# EAGLE design Spectacle_Button_Board (EAGLE 7.2.0)
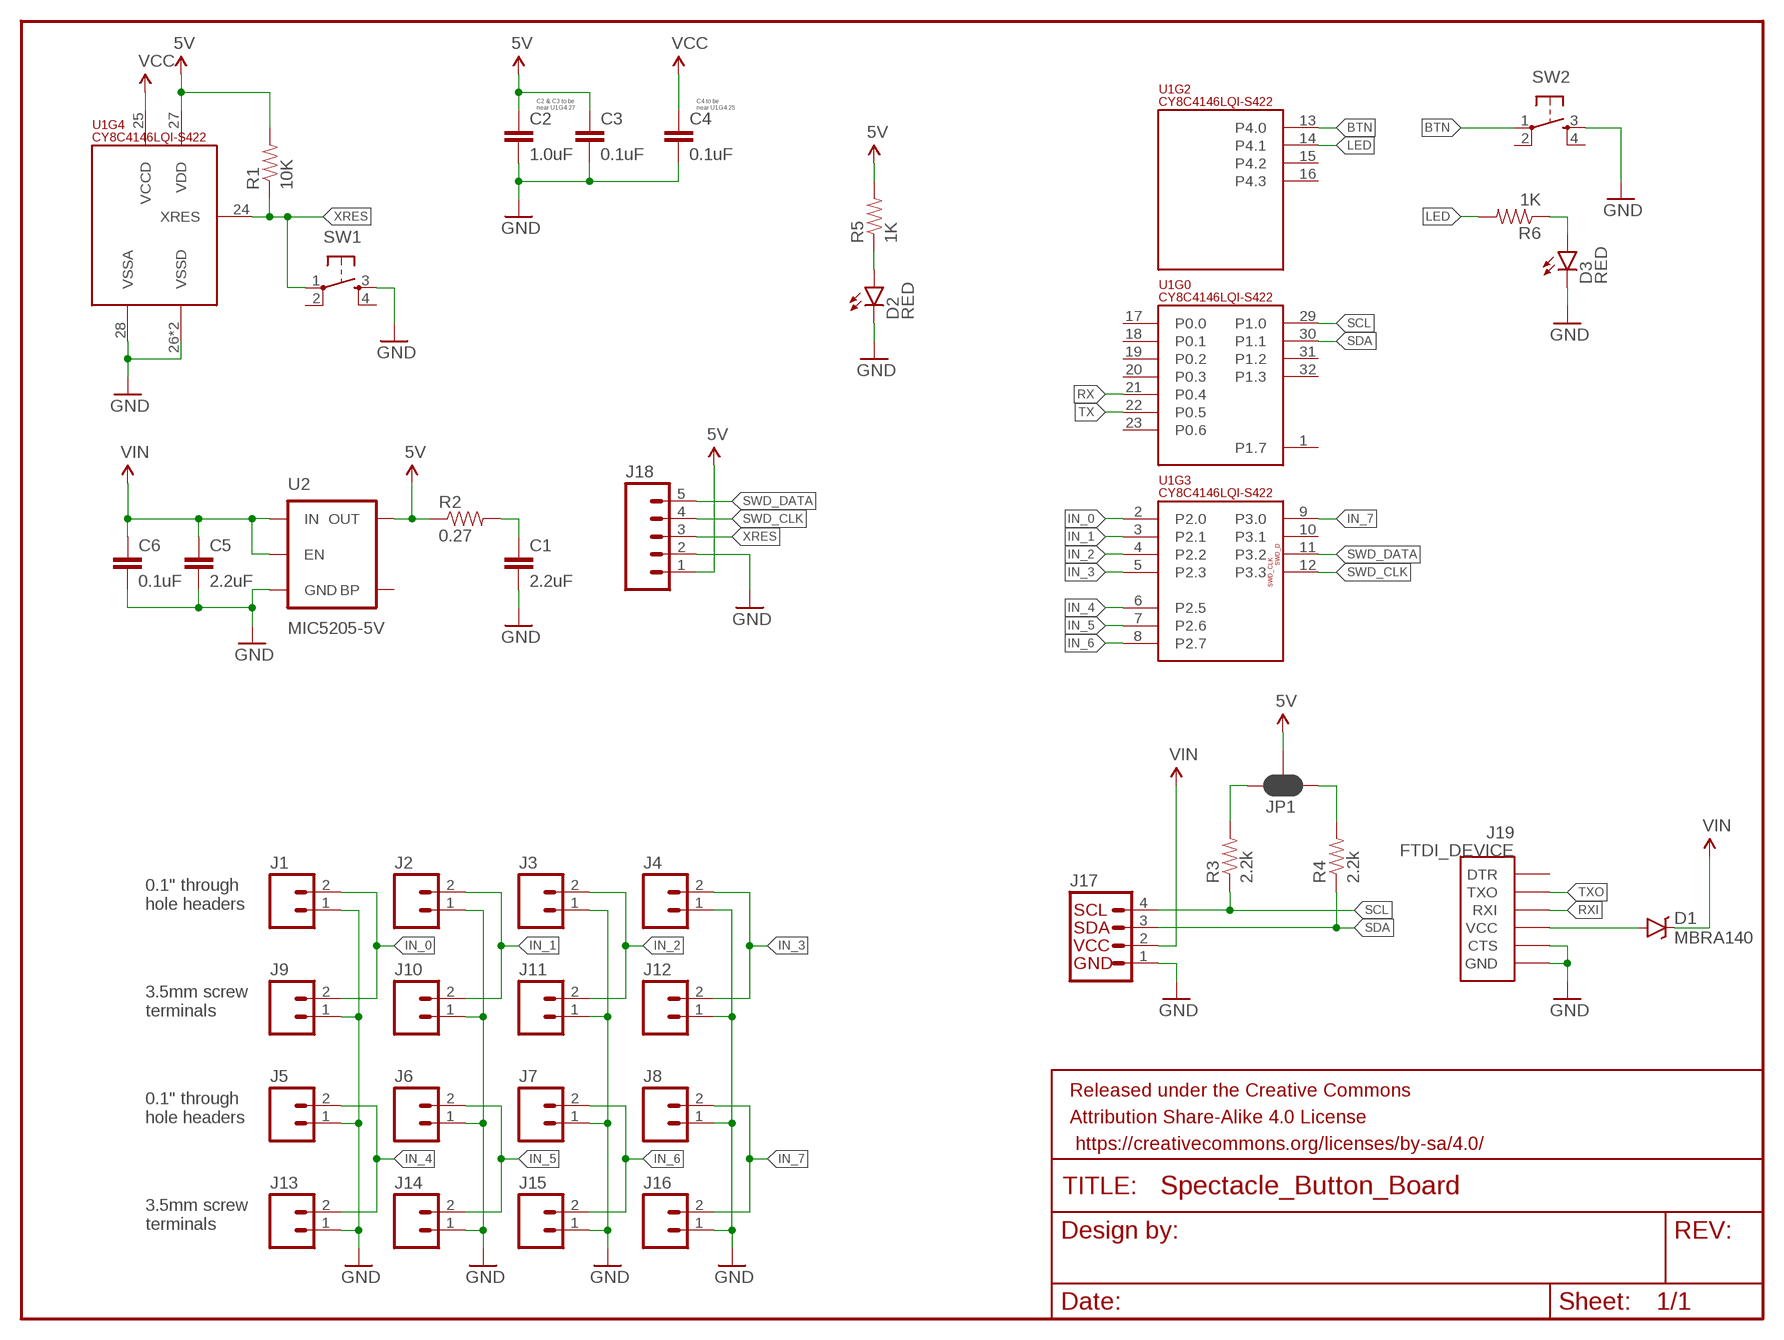
[diagram p0: schematic, sheet 1]

## Parts
C1  2.2uF  2.2UF-10V-20%(0603)  [0603-CAP]
C2  1.0uF  1.0UF-16V-10%(0402)  [0402-CAP]
C3  0.1uF  0.1UF-16V(+-10%)(0402)  [0402-CAP]
C4  0.1uF  0.1UF-16V(+-10%)(0402)  [0402-CAP]
C5  2.2uF  2.2UF-10V-20%(0603)  [0603-CAP]
C6  0.1uF  0.1UF-16V(+-10%)(0402)  [0402-CAP]
D1  MBRA140  DIODE-SCHOTTKY-MBRA140  [SMA-DIODE]
D2  RED  LED-RED0603  [LED-0603]
D3  RED  LED-RED0603  [LED-0603]
FRAME1  FRAME-LETTER  [CREATIVE_COMMONS]
J1  M02PTH  [1X02]
J2  M02PTH  [1X02]
J3  M02PTH  [1X02]
J4  M02PTH  [1X02]
J5  M02PTH  [1X02]
J6  M02PTH  [1X02]
J7  M02PTH  [1X02]
J8  M02PTH  [1X02]
J9  M023.5MM_LOCK  [SCREWTERMINAL-3.5MM-2_LOCK]
J10  M023.5MM_LOCK  [SCREWTERMINAL-3.5MM-2_LOCK]
J11  M023.5MM_LOCK  [SCREWTERMINAL-3.5MM-2_LOCK]
J12  M023.5MM_LOCK  [SCREWTERMINAL-3.5MM-2_LOCK]
J13  M023.5MM_LOCK  [SCREWTERMINAL-3.5MM-2_LOCK]
J14  M023.5MM_LOCK  [SCREWTERMINAL-3.5MM-2_LOCK]
J15  M023.5MM_LOCK  [SCREWTERMINAL-3.5MM-2_LOCK]
J16  M023.5MM_LOCK  [SCREWTERMINAL-3.5MM-2_LOCK]
J17  I2C_STANDARD  [1X04]
J18  M05PTH  [1X05]
J19  FTDI_DEVICE  [FTDI_DEVICE_SIDE]
JP1  JUMPER-PAD-3-NC_BY_PASTE  [PAD-JUMPER-3-NC_BY_PASTE_YES_SILK_FULL_BOX]
R1  10K  10KOHM-1/10W-1%(0603)0603  [0603-RES]
R2  0.27  0.27OHM-1/10W-1%(0603)  [0603-RES]
R3  2.2k  2.2KOHM-1/10W-1%(0603)  [0603-RES]
R4  2.2k  2.2KOHM-1/10W-1%(0603)  [0603-RES]
R5  1K  1KOHM-1/10W-1%(0603)  [0603-RES]
R6  1K  1KOHM-1/10W-1%(0603)  [0603-RES]
SW1  SWITCH_SPST_4_PINRECT  [TACTILE_SWITCH_SMD_4.6X2.8MM]
SW2  SWITCH_SPST_4_PINRECT  [TACTILE_SWITCH_SMD_4.6X2.8MM]
U1  CY8C4146LQI-S422  PSOC4_4100S_32QFN  [QFN-32]
U2  MIC5205-5V  V_REG_MIC52055V  [SOT23-5]

## Nets
5V: C2.1 C3.1 J18.1 JP1.2 R1.2 R2.1 R5.2 U1.27(VDD) U2.5(OUT)
BTN: SW2.1 U1.13(P4.0)
GND: C1.2 C2.2 C3.2 C4.2 C5.2 C6.2 D2.C D3.C J1.1 J2.1 J3.1 J4.1 J5.1 J6.1 J7.1 J8.1 J9.1 J10.1 J11.1 J12.1 J13.1 J14.1 J15.1 J16.1 J17.1 J18.2 J19.P$5(CTS) J19.P$6(GND) SW1.3 SW2.3 U1.26(VSSD) U1.28(VSSA) U1.EP(VSSD) U2.2(GND)
IN_0: J1.2 J9.2 U1.2(P2.0)
IN_1: J2.2 J10.2 U1.3(P2.1)
IN_2: J3.2 J11.2 U1.4(P2.2)
IN_3: J4.2 J12.2 U1.5(P2.3)
IN_4: J5.2 J13.2 U1.6(P2.5)
IN_5: J6.2 J14.2 U1.7(P2.6)
IN_6: J7.2 J15.2 U1.8(P2.7)
IN_7: J8.2 J16.2 U1.9(P3.0)
LED: R6.2 U1.14(P4.1)
N$1: D1.A J19.P$4(VCC)
N$2: JP1.3 R3.2
N$3: C1.1 R2.2
N$4: D2.A R5.1
N$5: D3.A R6.1
N$6: JP1.1 R4.2
RX: U1.21(P0.4)
RXI: J19.P$3(RXI)
SCL: J17.4 R3.1 U1.29(P1.0)
SDA: J17.3 R4.1 U1.30(P1.1)
SWD_CLK: J18.4 U1.12(P3.3)
SWD_DATA: J18.5 U1.11(P3.2)
TX: U1.22(P0.5)
TXO: J19.P$2(TXO)
VCC: C4.1 U1.25(VCCD)
VIN: C5.1 C6.1 D1.C J17.2 U2.1(IN) U2.3(EN)
XRES: J18.3 R1.1 SW1.1 U1.24(XRES)
Unconnected: J19.P$1(DTR) SW1.2 SW1.4 SW2.2 SW2.4 U1.1(P1.7) U1.10(P3.1) U1.15(P4.2) U1.16(P4.3) U1.17(P0.0) U1.18(P0.1) U1.19(P0.2) U1.20(P0.3) U1.23(P0.6) U1.31(P1.2) U1.32(P1.3) U2.4(BP)

## Notes on the sheet
- C2 & C3 to be
  near U1G4.27
- C4 to be
  near U1G4.25
- 0.1" through
  hole headers
- 3.5mm screw
  terminals
- 0.1" through
  hole headers
- 3.5mm screw
  terminals

## Library data of the parts
C1 C5 = SparkFun-Capacitors:2.2UF-10V-20%(0603): CAP-07888; PROD_ID: CAP-07888
C2 = SparkFun-Capacitors:1.0UF-16V-10%(0402); PROD_ID: CAP-12417
C3 C4 C6 = SparkFun-Capacitors:0.1UF-16V(+-10%)(0402); PROD_ID: CAP-12416
D1 = SparkFun-DiscreteSemi:DIODE-SCHOTTKY: Schottky diodes in SFE's production catalog BAT20J 1A 23V 0.62Vf RB751 120mA 40V 0.37Vf PMEG4005EJ 0.5A 40V 0.42Vf MBRA140 1A 40V 0.5Vf B340A 3A 40V SMA; PROD_ID: DIO-08053
D2 D3 = SparkFun-LED:LED-RED: Assorted Red LEDs LilyPad 1206- DIO-09912 1206- DIO-00809 0603- DIO-00819 "SMART" means more efficient and expensive; PROD_ID: DIO-00819
FRAME1 = SparkFun-Aesthetics:FRAME-LETTER: Schematic Frame Standard 8.5x11 US Letter frame
J1-J8 = SparkFun-Connectors:M02: Standard 2-pin 0.1" header. Use with - straight break away headers ( PRT-00116) - right angle break away headers (PRT-00553) - swiss pins (PRT-00743) - machine pins (PRT-00117) - female headers (PRT-00115) Molex polarized connector foot print use with: PRT-08233 with associated crimp pins and housings. 2.54_SCREWTERM for use with PRT-10571. 3.5mm Screw Terminal footprints for PRT-08084 5mm Screw Terminal footprints for use with PRT-08432
J9-J16 = SparkFun-Connectors:M02: Standard 2-pin 0.1" header. Use with - straight break away headers ( PRT-00116) - right angle break away headers (PRT-00553) - swiss pins (PRT-00743) - machine pins (PRT-00117) - female headers (PRT-00115) Molex polarized connector foot print use with: PRT-08233 with associated crimp pins and housings. 2.54_SCREWTERM for use with PRT-10571. 3.5mm Screw Terminal footprints for PRT-08084 5mm Screw Terminal footprints for use with PRT-08432; PROD_ID: CONN-08399
J17 = SparkFun-Connectors:I2C_STANDARD: SparkFun has standardized on a pinout for all I2C based sensor breakouts. This pinout allows I2C boards to be plugged directly into the headers on Arduino Uno compatible boards, and to be daisy chained easily.
J18 = SparkFun-Connectors:M05: Header 5 Standard 5-pin 0.1" header. Use with straight break away headers (SKU : PRT-00116), right angle break away headers (PRT-00553), swiss pins (PRT-00743), machine pins (PRT-00117), and female headers (PRT-00115). Molex polarized connector foot print use with SKU : PRT-08230 with associated crimp pins and housings.
J19 = SparkFun-Connectors:FTDI_DEVICE: Connector which mates to FTDI basic or FTDI cable.
JP1 = SparkFun-Passives:JUMPER-PAD-3-NC_BY_PASTE
R1 = SparkFun-Resistors:10KOHM-1/10W-1%(0603): RES-00824; PROD_ID: RES-00824
R2 = SparkFun-Resistors:0.27OHM-1/10W-1%(0603): RES-08787; PROD_ID: RES-08787
R3 R4 = SparkFun-Resistors:2.2KOHM-1/10W-1%(0603): RES-08272; PROD_ID: RES-08272
R5 R6 = SparkFun-Resistors:1KOHM-1/10W-1%(0603): RES-07856; PROD_ID: RES-07856
SW1 SW2 = SparkFun-Electromechanical:SWITCH_SPST_4_PIN; PROD_ID: SWCH-13065
U1 = SparkFun-DigitalIC:PSOC4_4100S_32QFN; PROD_ID: IC-13286
U2 = SparkFun-PowerIC:V_REG_MIC5205: V_REG MIC5205 Standard 3.3V, 5V, and Adjustable 150mA LDO voltage regulator in SOT-23 layout. Micrel part MIC5205. BP (by-pass) pin is used to lower output noise with 470pF cap, may be left open. On the adjustable version BP is used to set output.; PROD_ID: VREG-00823; VALUE: 5V

## Board
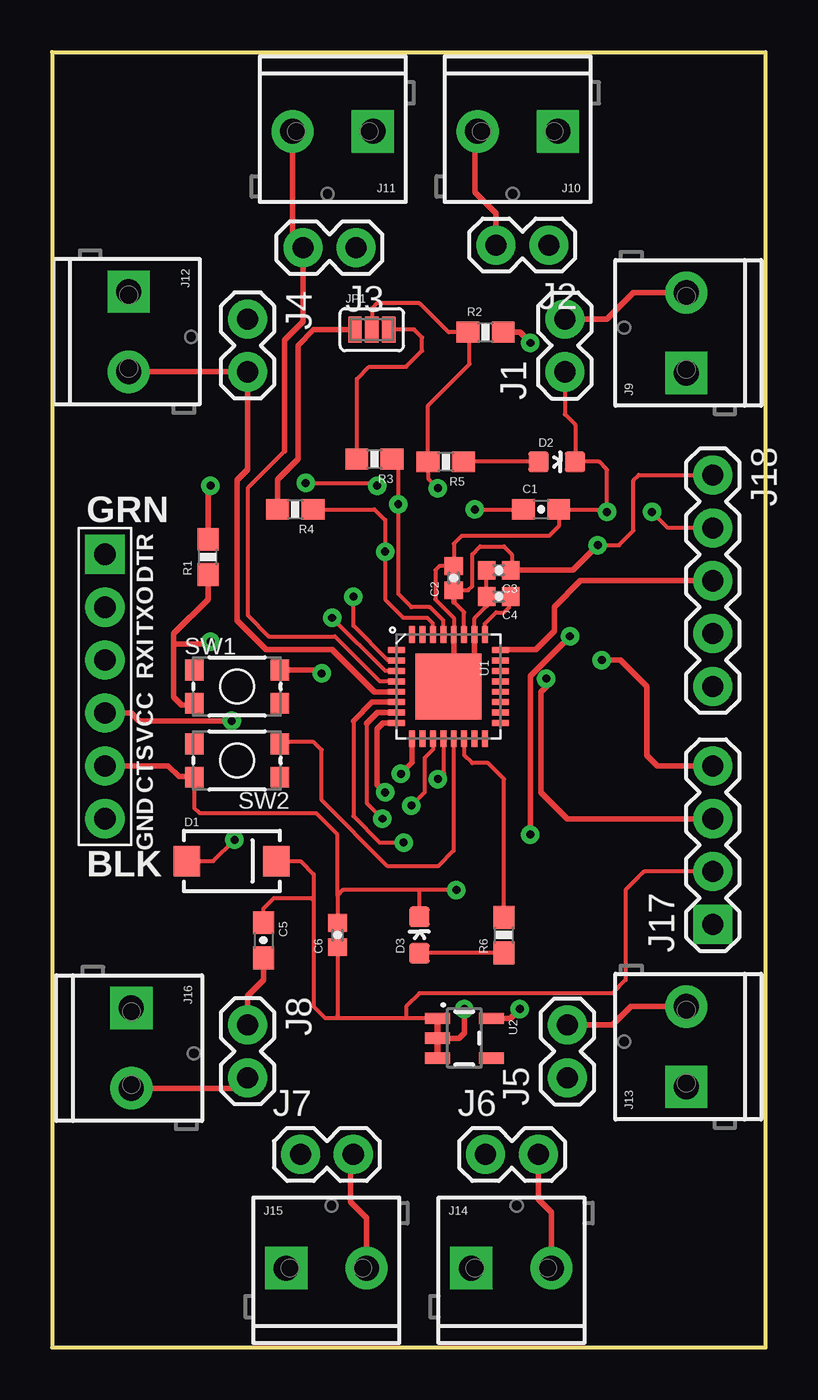
[diagram p1: board, top side]
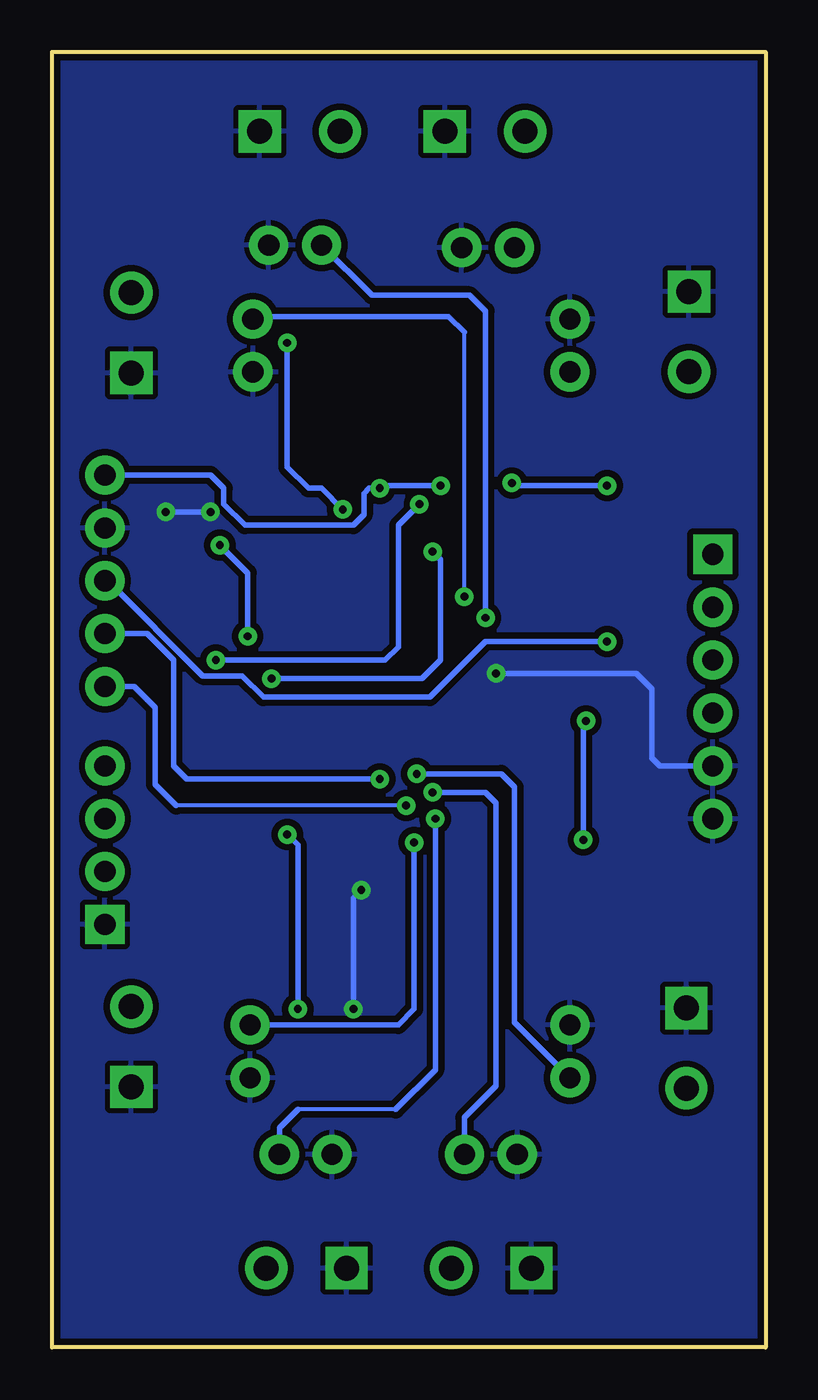
[diagram p2: board, bottom side, seen from below]

Size 34.29 x 62.23 mm. Coordinates in mm from the lower left corner, seen from the top.
Outline: 0,62.23 0,0 34.29,0 34.29,62.23 0,62.23
Copper layers (1*16): Top 0.035mm / dielectric 1.5mm / Bottom 0.035mm
Design rules "SparkFun-2-layer-STANDARD": minimum track width 10mil, minimum drill 20mil, track to track 10mil, track to pad 8mil, pad to pad 8mil, via to via 10mil, smd to smd 8mil, copper to edge 8mil, drill to drill 8mil, minimum pad ring 10mil, minimum via ring 10mil, stop-mask expansion 4mil, vias tented up to drill 20mil, thermal gap 10mil

### Footprints (pad centres in the part's own frame; a part is rotated, then mirrored left to right if it is on the bottom)
0603-CAP = smd 1.1 x 1: 1 -0.85,0; 2 0.85,0
0402-CAP = smd 0.85 x 0.9: 1 -0.58,0; 2 0.58,0
SMA-DIODE = smd 1.27 x 1.47: A -2.15,0; C 2.15,0
LED-0603 = smd 1 x 1: A 0,-0.877; C 0,0.877
1X02 = drill 1.016 pad 1.88: 1 0,0; 2 2.54,0
SCREWTERMINAL-3.5MM-2_LOCK = drill 1.2 pad 2.032 square: 1 -0.178,0 | drill 1.2 pad 2.032: 2 3.678,0
1X04 = drill 1.016 pad 1.88 square: 1 0,0 | drill 1.016 pad 1.88: 2 2.54,0; 3 5.08,0; 4 7.62,0
1X05 = drill 1.016 pad 1.88: 1 0,0; 2 2.54,0; 3 5.08,0; 4 7.62,0; 5 10.16,0
FTDI_DEVICE_SIDE = drill 1.016 pad 1.88 square: P$1 -6.35,0 | drill 1.016 pad 1.88: P$2 -3.81,0; P$3 -1.27,0; P$4 1.27,0; P$5 3.81,0; P$6 6.35,0
PAD-JUMPER-3-NC_BY_PASTE_YES_SILK_FULL_BOX = smd 0.635 x 1.27: 1 -0.813,0; 2 0,0; 3 0.813,0
0603-RES = smd 1.1 x 1: 1 -0.85,0; 2 0.85,0
TACTILE_SWITCH_SMD_4.6X2.8MM = smd 0.9 x 1: 1 -2.05,-0.8; 2 2.05,-0.8; 3 2.05,0.8; 4 -2.05,0.8
QFN-32 = smd 0.285 x 0.8: 1 -1.75,-2.5; 2 -1.25,-2.5; 3 -0.75,-2.5; 4 -0.25,-2.5; 5 0.25,-2.5; 6 0.75,-2.5; 7 1.25,-2.5; 8 1.75,-2.5; 17 1.75,2.5; 18 1.25,2.5; 19 0.75,2.5; 20 0.25,2.5; 21 -0.25,2.5; 22 -0.75,2.5; 23 -1.25,2.5; 24 -1.75,2.5 | smd 0.8 x 0.285: 9 2.5,-1.75; 10 2.5,-1.25; 11 2.5,-0.75; 12 2.5,-0.25; 13 2.5,0.25; 14 2.5,0.75; 15 2.5,1.25; 16 2.5,1.75; 25 -2.5,1.75; 26 -2.5,1.25; 27 -2.5,0.75; 28 -2.5,0.25; 29 -2.5,-0.25; 30 -2.5,-0.75; 31 -2.5,-1.25; 32 -2.5,-1.75 | smd 3.15 x 3.15: EP 0,0
SOT23-5 = smd 0.55 x 1.2: 1 -0.95,-1.3; 2 0,-1.3; 3 0.95,-1.3; 4 0.95,1.3; 5 -0.95,1.3

### Placement (x,y rotation side)
C1  23.5,40.26 0 top
C2  19.3,36.96 90 top
C3  21.46,37.34 180 top
C4  21.46,36.07 180 top
C5  10.16,19.56 270 top
C6  13.72,19.81 90 top
D1  8.64,23.37 0 top
D2  24.26,42.55 270 top
D3  17.65,19.81 0 top
FRAME1  40.64,-60.96 0 top  (outside the outline)
J1  24.64,46.86 90 top
J2  23.88,52.96 180 top
J3  14.61,52.83 180 top
J4  9.4,49.4 270 top
J5  24.77,12.95 90 top
J6  20.83,9.27 0 top
J7  11.94,9.27 0 top
J8  9.4,15.49 270 top
J9  30.48,46.99 90 top
J10  24.13,58.42 180 top
J11  15.24,58.42 180 top
J12  3.68,50.55 270 top
J13  30.48,12.7 90 top
J14  20.32,3.81 0 top
J15  11.43,3.81 0 top
J16  3.81,16.13 270 top
J17  31.75,20.32 90 top
J18  31.75,41.91 270 top
J19  2.54,31.75 270 top
JP1  15.37,48.9 0 top
R1  7.49,37.97 90 top
R2  20.83,48.77 0 top
R3  15.49,42.67 180 top
R4  11.68,40.26 180 top
R5  18.92,42.55 180 top
R6  21.72,19.81 90 top
SW1  8.89,31.75 0 top
SW2  8.89,28.19 180 top
U1  19.05,31.75 270 top
U2  19.81,14.86 270 top

### Tracks (layer width: path | path; a pad name or v marks a point on that pad's centre or on a via)
5V  (via drill 0.38)
  Top 0.203: 19.3,35.81 19.81,35.31 19.8,35.29 U1.27 | R2.1 19.05,48.77 17.65,50.16 15.62,50.16 15.37,49.91 JP1.2 | 20.07,48.68 20.07,47.24 18.07,45.25 R5.2 18.07,41.74 v18.54,41.28 | C2.1 19.99,36.38 20.19,36.58 20.19,38.1 20.57,38.48 21.72,38.48 22.1,38.1 22.1,37.39 | v12.19,41.53 15.49,41.53 v15.62,41.4 | v26.23,38.54 27.24,38.54 27.94,39.24 27.94,41.66 28.19,41.91 J18.1
  Top 0.254: C2.1 19.3,35.81 | 20.07,48.68 R2.1 | 22.1,37.39 C3.1 25.02,37.34 v26.23,38.54 | R1.2 7.49,41.28 v7.62,41.4 | U2.5 22.03,15.81 v22.48,16.26 | v22.99,24.64 22.99,32.26 v24.89,34.16
  Bottom 0.254: J18.1 26.67,41.91 26.04,41.28 26.04,40.51 25.02,39.5 19.81,39.5 19.3,40.01 19.3,41.02 19.05,41.28 v18.54,41.28 18.41,41.4 v15.62,41.4 | v7.62,41.4 12.07,41.4 v12.19,41.53 | v22.48,16.26 22.48,24.13 v22.99,24.64 | v24.89,34.16 24.89,37.21 v26.23,38.54
BTN
  Top 0.203: U1.13 19.3,23.87 18.54,23.11 16.13,23.11 12.95,26.29 12.95,28.7 12.57,29.08 11.03,29.08
  Top 0.254: 11.03,29.08 SW2.1
GND  (via drill 0.38)
  Top 0.203: U1.28 19.3,35.05 18.41,35.94 18.41,37.34 18.61,37.54 C2.2 19.3,38.61 19.69,38.99 23.88,38.99 24.35,39.46 C1.2 26.54,40.26 | U1.26 20.3,35.03 20.88,35.62 C4.2 C3.2 | J1.1 24.64,44.83 25.15,44.32 25.15,42.56 | v19.43,21.97 17.65,21.97 | 17.65,21.97 13.97,21.97 13.72,21.72 | 13.72,21.72 C6.2 | 13.72,21.72 13.72,24.64 12.7,25.65 7.11,25.65 6.84,25.93 SW2.3 | D3.C 17.65,21.97 | J18.2 29.59,39.37 v28.83,40.13 | v26.67,40.13 26.67,42.16 26.29,42.55 D2.C
  Top 0.254: U1.28 19.3,32 U1.EP | 25.15,42.56 D2.C | J19.P$5 5.59,27.94 6.1,27.43 6.8,27.43 SW2.3 | SW1.3 12.79,32.55 v12.95,32.38 | C5.2 10.16,17.65 9.4,16.89 J8.1 | U2.2 19.56,14.86 19.81,15.11 v19.81,16.26 | 26.54,40.26 v26.67,40.13 | U1.EP 19.05,31.88 19.81,32.64 | U1.26 20.3,33 U1.EP
  Bottom 0.254: v12.95,32.38 6.22,32.38 5.46,31.62 5.46,28.32 5.08,27.94 J19.P$5 | v19.81,16.26 19.81,21.59 v19.43,21.97 | v28.83,40.13 v26.67,40.13
  pour Bottom (isolate 0.305): 0,62.23 34.29,62.23 34.29,0 0,0
IN_0  (via drill 0.38)
  Top 0.203: U1.2 16.15,33 14.48,34.67 v14.48,36.07
  Top 0.254: J9.2 27.94,50.67 26.67,49.4 J1.2
  Bottom 0.203: v14.48,36.07 14.48,48.77
  Bottom 0.254: 14.48,48.77 15.24,49.53 24.51,49.53 J1.2
IN_1  (via drill 0.38)
  Top 0.203: U1.3 16.01,32.5 v13.46,35.05
  Top 0.254: J10.2 20.32,58.42 20.32,55.5 21.34,54.48 J2.2
  Bottom 0.254: v13.46,35.05 13.46,49.78 14.22,50.55 18.92,50.55 J2.2
IN_2
  Top 0.203: 11.18,43.05 9.4,41.28 9.4,35.18 10.41,34.16 13.59,34.16 15.75,32 U1.4
  Top 0.254: J11.2 11.56,53.34 J3.2 12.07,49.28 11.18,48.39 11.18,43.05 | U1.4
IN_3
  Top 0.254: J12.2 J4.2 9.4,42.16 8.89,41.66 8.89,34.92 10.29,33.53 13.46,33.53 15.49,31.5 U1.5
IN_4  (via drill 0.38)
  Top 0.203: 14.48,30.1 14.48,25.53 15.75,24.26 v16.89,24.26
  Top 0.254: J13.2 27.81,16.38 26.92,15.49 J5.2 | U1.6 15.38,31 14.48,30.1
  Bottom 0.254: v16.89,24.26 16.89,16.26 17.65,15.49 J5.2
IN_5  (via drill 0.38)
  Top 0.203: 15.11,29.97 15.11,26.16 v15.88,25.4
  Top 0.254: J14.2 24,6.48 23.37,7.11 J6.2 | U1.7 15.64,30.5 15.11,29.97
  Bottom 0.203: 17.78,11.43 22.48,11.43
  Bottom 0.254: v15.88,25.4 15.88,13.34 17.78,11.43 | 22.48,11.43 23.37,10.54 J6.2
IN_6  (via drill 0.38)
  Top 0.254: J15.2 15.11,6.23 14.35,6.98 14.35,9.14 J7.2 | U1.8 15.9,30 15.62,29.72 15.62,27.05 v16,26.67
  Bottom 0.254: v16,26.67 13.46,26.67 12.95,26.16 12.95,12.57 14.48,11.05 J7.2
IN_7  (via drill 0.38)
  Top 0.254: J16.2 8.9,12.45 J8.2 | U1.9 17.3,28.09 v16.76,27.56
  Bottom 0.254: v16.76,27.56 12.7,27.56 12.07,26.92 12.07,15.62 J8.2
LED
  Top 0.203: R6.2 21.72,27.3 20.96,28.07 20.19,28.07 19.8,28.46 U1.14
N$1  (via drill 0.38)
  Top 0.203: D1.A 7.75,23.37 v8.76,24.38
  Top 0.254: v8.64,30.1 4.19,30.1 3.81,30.48 J19.P$4
  Bottom 0.254: v8.76,24.38 8.76,29.97 v8.64,30.1
N$2
  Top 0.203: R3.2 14.64,46.52 15.24,47.12 17.02,47.12 17.78,47.88 17.78,48.51 17.4,48.9 JP1.3
N$3  (via drill 0.38)
  Top 0.203: v20.32,40.26 C1.1
  Top 0.254: R2.2 22.48,48.77 v22.99,48.26
  Bottom 0.254: v22.99,48.26 22.99,42.29 21.97,41.28 21.34,41.28 v20.32,40.26
N$4
  Top 0.203: D2.A R5.1
N$5
  Top 0.203: R6.1 17.68,18.96
  Top 0.254: 17.68,18.96 D3.A
N$6
  Top 0.254: R4.2 10.83,41.7 11.81,42.67 11.81,48.13 12.57,48.9 JP1.1
SCL  (via drill 0.38)
  Top 0.203: U1.29 18.8,34.92 18.16,35.56 17.27,35.56 16.64,36.2 v16.64,40.51 16.64,42.38
  Top 0.254: 16.64,42.38 R3.1 | J17.4 29.08,27.94 28.58,28.45 28.58,31.75 27.31,33.02 v26.42,33.02
  Bottom 0.254: v26.42,33.02 18.29,33.02 17.65,33.66 17.65,39.5 v16.64,40.51
SDA  (via drill 0.38)
  Top 0.203: R4.1 15.49,40.26 16,39.75 v16,38.23 16,35.94 16.89,35.05 18.03,35.05 18.3,34.79 U1.30
  Top 0.254: J17.3 24.77,25.4 23.5,26.67 23.5,31.5 23.75,31.75 v23.75,32.13
  Bottom 0.254: v23.75,32.13 16.51,32.13 15.62,33.02 15.62,37.85 v16,38.23
SWD_CLK  (via drill 0.38)
  Top 0.203: U1.12 18.8,27.56
  Top 0.254: 18.8,27.56 v18.54,27.3
  Bottom 0.254: v18.54,27.3 27.81,27.3 28.45,27.94 28.45,33.02 29.72,34.29 J18.4
SWD_DATA  (via drill 0.38)
  Top 0.203: U1.11 18.3,28.71 17.91,28.32 17.91,26.67 v17.27,26.04
  Bottom 0.203: v17.27,26.04 28.32,26.04
  Bottom 0.254: 28.32,26.04 29.34,27.05 29.34,30.73 30.35,31.75 J18.5
VCC
  Top 0.203: U1.25 20.8,34.77 21.34,35.31 21.72,35.31 21.97,35.56 21.97,36
  Top 0.254: 21.97,36 C4.1
VIN
  Top 0.203: D1.C 11.94,23.37 12.57,22.73 12.57,21.46 | 12.57,21.46 12.57,16.38 13.15,15.81 13.84,15.81 | U2.1 17.02,15.81 | 17.02,15.81 13.84,15.81 | C5.1 10.16,21.08 10.67,21.59 12.45,21.59 12.57,21.46 | J17.2 28.45,22.86 27.56,21.97 27.56,17.65 26.92,17.02 17.65,17.02 17.02,16.38 17.02,15.81 | C6.1 13.72,15.94 13.84,15.81
  Top 0.305: U2.1 U2.3
XRES  (via drill 0.38)
  Top 0.254: R1.1 7.49,35.94 5.84,34.29 5.84,33.78 | 5.84,33.78 5.84,31.24 6.22,30.86 6.75,30.86 SW1.1 | J18.3 25.4,36.83 24.13,35.56 24.13,34.42 23.24,33.53 21.58,33.53 U1.24 | 5.84,33.78 7.49,33.78 v7.62,33.91
  Bottom 0.254: v7.62,33.91 13.46,33.91 16.13,31.24 24.13,31.24 25.15,32.26 27.05,32.26 31.62,36.83 J18.3